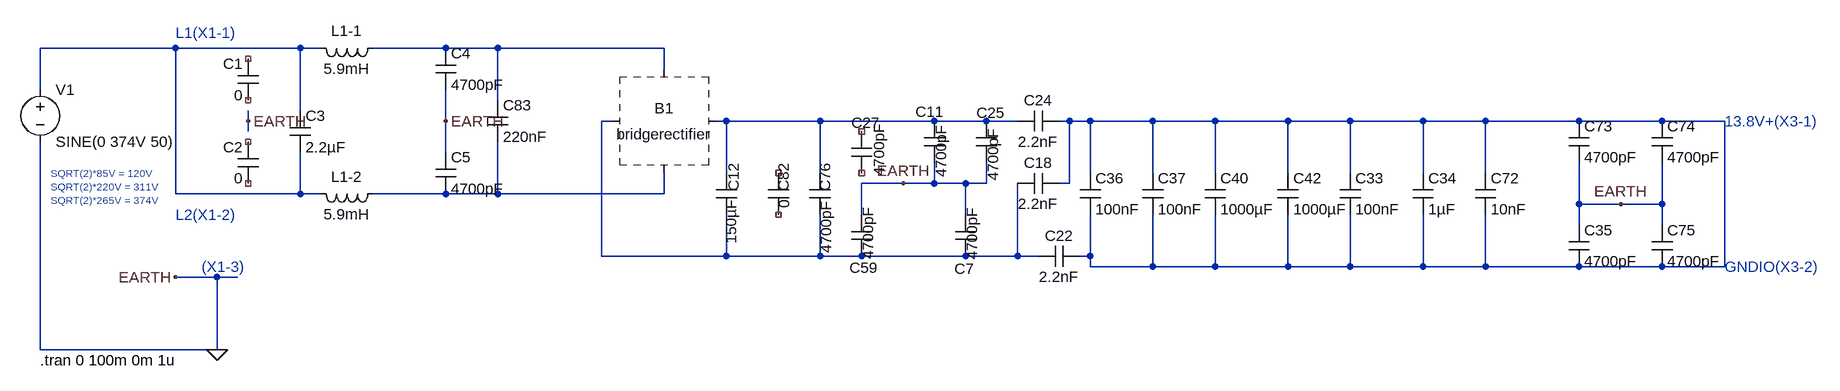
[diagram p0: schematic 150W-Leakeage-Model.asc]
150W-Leakeage-Model.asc, the LTspice schematic file:
Version 4
SHEET 1 2372 680
WIRE -176 -128 -384 -128
WIRE 16 -128 -176 -128
WIRE 48 -128 16 -128
WIRE 240 -128 128 -128
WIRE 320 -128 240 -128
WIRE 576 -128 320 -128
WIRE 576 -96 576 -128
WIRE -384 -64 -384 -128
WIRE 320 -48 320 -128
WIRE 16 -32 16 -128
WIRE -64 -16 -64 -32
WIRE 240 -16 240 -64
WIRE 496 -16 480 -16
WIRE 672 -16 656 -16
WIRE 816 -16 672 -16
WIRE 992 -16 816 -16
WIRE 1072 -16 992 -16
WIRE 1120 -16 1072 -16
WIRE 1200 -16 1184 -16
WIRE 1232 -16 1200 -16
WIRE 1328 -16 1232 -16
WIRE 1424 -16 1328 -16
WIRE 1536 -16 1424 -16
WIRE 1632 -16 1536 -16
WIRE 1744 -16 1632 -16
WIRE 1840 -16 1744 -16
WIRE 1984 -16 1840 -16
WIRE 2112 -16 1984 -16
WIRE 2208 -16 2112 -16
WIRE -64 0 -64 -16
WIRE 240 32 240 -16
WIRE 672 64 672 -16
WIRE 816 64 816 -16
WIRE 1232 64 1232 -16
WIRE 1328 64 1328 -16
WIRE 1424 64 1424 -16
WIRE 1536 64 1536 -16
WIRE 1632 64 1632 -16
WIRE 1744 64 1744 -16
WIRE 1840 64 1840 -16
WIRE 944 80 880 80
WIRE 992 80 992 48
WIRE 992 80 944 80
WIRE 1040 80 992 80
WIRE 1072 80 1072 48
WIRE 1072 80 1040 80
WIRE 1200 80 1200 -16
WIRE 1200 80 1184 80
WIRE -176 96 -176 -128
WIRE 16 96 16 32
WIRE 16 96 -176 96
WIRE 48 96 16 96
WIRE 240 96 128 96
WIRE 320 96 320 16
WIRE 320 96 240 96
WIRE 576 96 576 64
WIRE 576 96 320 96
WIRE 1984 112 1984 48
WIRE 2048 112 1984 112
WIRE 2112 112 2112 48
WIRE 2112 112 2048 112
WIRE 880 128 880 80
WIRE 1040 128 1040 80
WIRE 1984 144 1984 112
WIRE 2112 144 2112 112
WIRE 480 192 480 -16
WIRE 672 192 672 128
WIRE 672 192 480 192
WIRE 816 192 816 128
WIRE 816 192 672 192
WIRE 880 192 816 192
WIRE 1040 192 880 192
WIRE 1120 192 1120 80
WIRE 1120 192 1040 192
WIRE 1152 192 1120 192
WIRE 1232 192 1232 128
WIRE 1232 192 1216 192
WIRE 1232 208 1232 192
WIRE 1328 208 1328 128
WIRE 1328 208 1232 208
WIRE 1424 208 1424 128
WIRE 1424 208 1328 208
WIRE 1536 208 1536 128
WIRE 1536 208 1424 208
WIRE 1632 208 1632 128
WIRE 1632 208 1536 208
WIRE 1744 208 1744 128
WIRE 1744 208 1632 208
WIRE 1840 208 1840 128
WIRE 1840 208 1744 208
WIRE 1984 208 1840 208
WIRE 2112 208 1984 208
WIRE 2208 208 2208 -16
WIRE 2208 208 2112 208
WIRE -112 224 -176 224
WIRE -80 224 -112 224
WIRE -384 336 -384 16
WIRE -112 336 -112 224
WIRE -112 336 -384 336
FLAG 240 -16 EARTH
FLAG 2048 112 EARTH
FLAG -176 224 EARTH
FLAG -112 336 0
FLAG 944 80 EARTH
FLAG -64 -16 EARTH
SYMBOL cap 0 -32 R0
SYMATTR InstName C3
SYMATTR Value 2.2µF
SYMBOL cap -48 -48 R180
WINDOW 0 24 56 Left 2
WINDOW 3 24 8 Left 2
SYMATTR InstName C1
SYMATTR Value 0
SYMBOL cap -48 80 R180
WINDOW 0 24 56 Left 2
WINDOW 3 24 8 Left 2
SYMATTR InstName C2
SYMATTR Value 0
SYMBOL cap 304 -48 R0
SYMATTR InstName C83
SYMATTR Value 220nF
SYMBOL cap 224 -128 R0
SYMATTR InstName C4
SYMATTR Value 4700pF
SYMBOL cap 224 32 R0
SYMATTR InstName C5
SYMATTR Value 4700pF
SYMBOL cap 736 64 R0
WINDOW 0 24 -16 VRight 2
WINDOW 3 25 41 VRight 2
SYMATTR InstName C82
SYMATTR Value 0
SYMBOL cap 976 -16 R0
WINDOW 0 -13 -14 Left 2
WINDOW 3 26 4 VRight 2
SYMATTR InstName C11
SYMATTR Value 4700pF
SYMBOL cap 1024 128 R0
WINDOW 0 -1 83 Left 2
WINDOW 3 26 -13 VRight 2
SYMATTR InstName C7
SYMATTR Value 4700pF
SYMBOL cap 656 64 R0
WINDOW 0 27 -16 VRight 2
WINDOW 3 23 40 VRight 2
SYMATTR InstName C12
SYMATTR Value 150µF
SYMBOL cap 1312 64 R0
SYMATTR InstName C37
SYMATTR Value 100nF
SYMBOL ind 144 -144 R90
WINDOW 0 5 56 VBottom 2
WINDOW 3 32 56 VTop 2
SYMATTR InstName L1-1
SYMATTR Value 5.9mH
SYMBOL ind 144 80 R90
WINDOW 0 5 56 VBottom 2
WINDOW 3 32 56 VTop 2
SYMATTR InstName L1-2
SYMATTR Value 5.9mH
SYMBOL ZZZ\\bridgerectifier\\bridgerectifier 576 -16 R0
SYMATTR InstName B1
SYMBOL cap 1184 64 R90
WINDOW 0 0 32 VBottom 2
WINDOW 3 32 32 VTop 2
SYMATTR InstName C18
SYMATTR Value 2.2nF
SYMBOL cap 1216 64 R0
SYMATTR InstName C36
SYMATTR Value 100nF
SYMBOL cap 1408 64 R0
SYMATTR InstName C40
SYMATTR Value 1000µF
SYMBOL cap 1520 64 R0
SYMATTR InstName C42
SYMATTR Value 1000µF
SYMBOL cap 1968 -16 R0
SYMATTR InstName C73
SYMATTR Value 4700pF
SYMBOL cap 2096 -16 R0
SYMATTR InstName C74
SYMATTR Value 4700pF
SYMBOL cap 1968 144 R0
SYMATTR InstName C35
SYMATTR Value 4700pF
SYMBOL cap 2096 144 R0
SYMATTR InstName C75
SYMATTR Value 4700pF
SYMBOL voltage -384 -80 R0
WINDOW 123 0 0 Left 0
WINDOW 39 0 0 Left 0
SYMATTR InstName V1
SYMATTR Value SINE(0 374V 50)
SYMBOL cap 864 128 R0
WINDOW 0 -3 82 Left 2
WINDOW 3 26 -14 VRight 2
SYMATTR InstName C59
SYMATTR Value 4700pF
SYMBOL cap 864 0 R0
WINDOW 0 0 -13 Left 2
WINDOW 3 43 -14 VRight 2
SYMATTR InstName C27
SYMATTR Value 4700pF
SYMBOL cap 1216 176 R90
WINDOW 0 0 32 VBottom 2
WINDOW 3 32 32 VTop 2
SYMATTR InstName C22
SYMATTR Value 2.2nF
SYMBOL cap 1184 -32 R90
WINDOW 0 0 32 VBottom 2
WINDOW 3 32 32 VTop 2
SYMATTR InstName C24
SYMATTR Value 2.2nF
SYMBOL cap 1056 -16 R0
WINDOW 0 1 -13 Left 2
WINDOW 3 26 92 VLeft 2
SYMATTR InstName C25
SYMATTR Value 4700pF
SYMBOL cap 1616 64 R0
SYMATTR InstName C33
SYMATTR Value 100nF
SYMBOL cap 1728 64 R0
SYMATTR InstName C34
SYMATTR Value 1µF
SYMBOL cap 1824 64 R0
SYMATTR InstName C72
SYMATTR Value 10nF
SYMBOL cap 800 64 R0
WINDOW 0 24 -16 VRight 2
WINDOW 3 25 41 VRight 2
SYMATTR InstName C76
SYMATTR Value 4700pF
TEXT -176 -152 Left 2 ;L1(X1-1)
TEXT -176 128 Left 2 ;L2(X1-2)
TEXT -136 208 Left 2 ;(X1-3)
TEXT 2208 -16 Left 2 ;13.8V+(X3-1)
TEXT 2208 208 Left 2 ;GNDIO(X3-2)
TEXT -368 64 Left 1 ;SQRT(2)*85V = 120V\nSQRT(2)*220V = 311V\nSQRT(2)*265V = 374V
TEXT -384 352 Left 2 !.tran 0 100m 0m 1u

The netlist it stands for:
* 150W-Leakeage-Model.asc
C3 N001 N001 2.2µF
C1 NC_01 NC_02 0
C2 NC_03 NC_04 0
C83 N002 N006 220nF
C4 N002 0 4700pF
C5 0 N006 4700pF
C82 NC_05 NC_06 0
C11 N004 0 4700pF
C7 0 N003 4700pF
C12 N004 N003 150µF
C37 N005 N005 100nF
L1-1 N002 N001 5.9mH
L1-2 N006 N001 5.9mH
* B1: bridgerectifier (symbol ZZZ\bridgerectifier\bridgerectifier not available, pin order unknown); nets seen at it: N002, N003, N004, N006
C18 N005 N003 2.2nF
C36 N005 N005 100nF
C40 N005 N005 1000µF
C42 N005 N005 1000µF
C73 N005 0 4700pF
C74 N005 0 4700pF
C35 0 N005 4700pF
C75 0 N005 4700pF
V1 N001 0 SINE(0 374V 50)
C59 0 N003 4700pF
C27 NC_07 NC_08 4700pF
C22 N005 N003 2.2nF
C24 N005 N004 2.2nF
C25 N004 0 4700pF
C33 N005 N005 100nF
C34 N005 N005 1µF
C72 N005 N005 10nF
C76 N004 N003 4700pF
* L1(X1-1)
* L2(X1-2)
* (X1-3)
* 13.8V+(X3-1)
* GNDIO(X3-2)
* SQRT(2)*85V = 120V
* SQRT(2)*220V = 311V
* SQRT(2)*265V = 374V
.tran 0 100m 0m 1u
.backanno
.end